# EAGLE design DIP-HDMI-v1.0 (EAGLE 7.6.0)

## Sheet 1 of 3
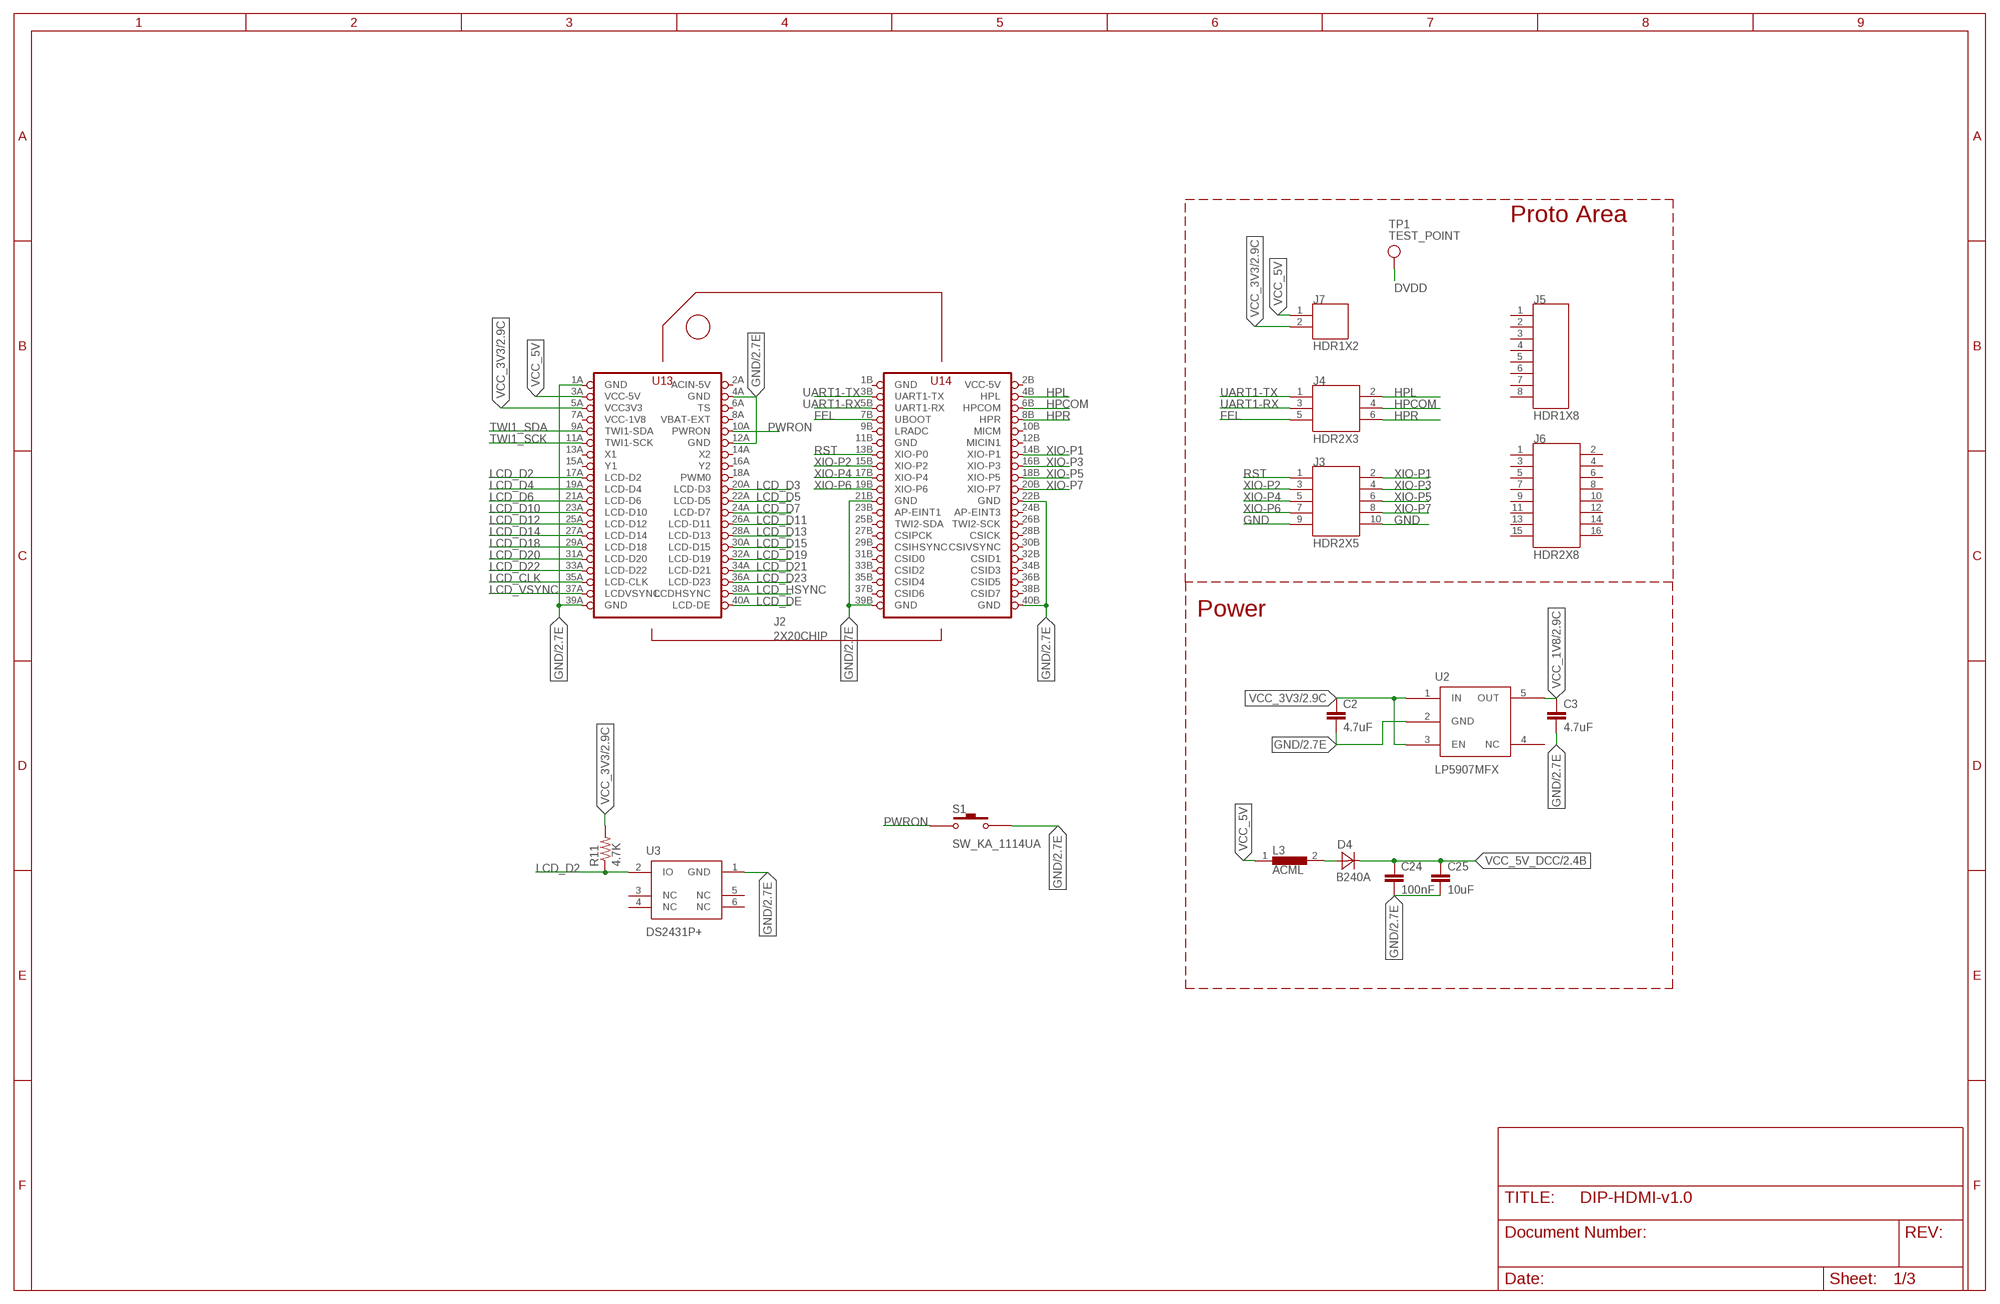
[diagram p0: schematic, sheet 1]

### Parts
C2  4.7uF  CAPACITOR  [1608_0603]
C3  4.7uF  CAPACITOR  [1608_0603]
C24  100nF  CAPACITOR  [1608_0603]
C25  10uF  CAPACITOR  [1608_0603]
D4  B240A  [SMA]
J2  2X20CHIP  [HDR2X2X20H]
J3  HDR2X5  [HDR2X5]
J4  HDR2X3  [HDR2X3]
J5  HDR1X8  [HDR1X8]
J6  HDR2X8  [HDR2X8]
J7  HDR1X2  [HDR1X2]
L3  ACML  [0603]
R11  4.7K  RESISTOR  [J1-0603]
S1  SW_KA_1114UA  [SW_KA_1114UA]
TP1  TEST_POINT  [TP-1MMX1MM]
U2  LP5907MFX  [SOT23-5]
U3  DS2431P+  [DS2431P+T&R]

### Nets
DVDD: TP1.0 ; also sheet 2
FEL: J2.7B(UBOOT) J4.5
GND: C2.2 C3.2 C24.2 C25.2 J2.1A(GND) J2.4A(GND) J2.12A(GND) J2.21B(GND) J2.22B(GND) J2.39A(GND) J2.39B(GND) J2.40B(GND) J3.9 J3.10 S1.3 S1.4 U2.2(GND) U3.1(GND) ; also sheet 2,3
HPCOM: J2.6B(HPCOM) J4.4
HPL: J2.4B(HPL) J4.2
HPR: J2.8B(HPR) J4.6
LCD_CLK: J2.35A(LCD-CLK) ; also sheet 2
LCD_D2: J2.17A(LCD-D2) R11.1 U3.2(IO)
LCD_D3: J2.20A(LCD-D3) ; also sheet 2
LCD_D4: J2.19A(LCD-D4) ; also sheet 2
LCD_D5: J2.22A(LCD-D5) ; also sheet 2
LCD_D6: J2.21A(LCD-D6) ; also sheet 2
LCD_D7: J2.24A(LCD-D7) ; also sheet 2
LCD_D10: J2.23A(LCD-D10) ; also sheet 2
LCD_D11: J2.26A(LCD-D11) ; also sheet 2
LCD_D12: J2.25A(LCD-D12) ; also sheet 2
LCD_D13: J2.28A(LCD-D13) ; also sheet 2
LCD_D14: J2.27A(LCD-D14) ; also sheet 2
LCD_D15: J2.30A(LCD-D15) ; also sheet 2
LCD_D18: J2.29A(LCD-D18) ; also sheet 2
LCD_D19: J2.32A(LCD-D19) ; also sheet 2
LCD_D20: J2.31A(LCD-D20) ; also sheet 2
LCD_D21: J2.34A(LCD-D21) ; also sheet 2
LCD_D22: J2.33A(LCD-D22) ; also sheet 2
LCD_D23: J2.36A(LCD-D23) ; also sheet 2
LCD_DE: J2.40A(LCD-DE) ; also sheet 2
LCD_HSYNC: J2.38A(LCDHSYNC) ; also sheet 2
LCD_VSYNC: J2.37A(LCDVSYNC) ; also sheet 2
N$7: D4.1(A) L3.2
PWRON: J2.10A(PWRON) S1.1 S1.2
RST: J2.13B(XIO-P0) J3.1 ; also sheet 2
TWI1_SCK: J2.11A(TWI1-SCK) ; also sheet 2,3
TWI1_SDA: J2.9A(TWI1-SDA) ; also sheet 2,3
UART1-RX: J2.5B(UART1-RX) J4.3
UART1-TX: J2.3B(UART1-TX) J4.1
VCC_1V8: C3.1 U2.5(OUT) ; also sheet 2
VCC_3V3: C2.1 J2.5A(VCC3V3) J7.2 R11.2 U2.1(IN) U2.3(EN) ; also sheet 2
VCC_5V: J2.3A(VCC-5V) J7.1 L3.1
VCC_5V_DCC: C24.1 C25.1 D4.2(C) ; also sheet 2,3
XIO-P1: J2.14B(XIO-P1) J3.2
XIO-P2: J2.15B(XIO-P2) J3.3
XIO-P3: J2.16B(XIO-P3) J3.4
XIO-P4: J2.17B(XIO-P4) J3.5
XIO-P5: J2.18B(XIO-P5) J3.6
XIO-P6: J2.19B(XIO-P6) J3.7
XIO-P7: J2.20B(XIO-P7) J3.8
Unconnected: J2.2A(ACIN-5V) J2.6A(TS) J2.8A(VBAT-EXT) J2.9B(LRADC) J2.10B(MICM) J2.12B(MICIN1) J2.13A(X1) J2.14A(X2) J2.15A(Y1) J2.16A(Y2) J2.18A(PWM0) J2.23B(AP-EINT1) J2.24B(AP-EINT3) J2.25B(TWI2-SDA) J2.26B(TWI2-SCK) J2.27B(CSIPCK) J2.28B(CSICK) J2.29B(CSIHSYNC) J2.30B(CSIVSYNC) J2.31B(CSID0) J2.32B(CSID1) J2.33B(CSID2) J2.34B(CSID3) J2.35B(CSID4) J2.36B(CSID5) J2.37B(CSID6) J2.38B(CSID7) J5.1 J5.2 J5.3 J5.4 J5.5 J5.6 J5.7 J5.8 J6.1 J6.2 J6.3 J6.4 J6.5 J6.6 J6.7 J6.8 J6.9 J6.10 J6.11 J6.12 J6.13 J6.14 J6.15 J6.16 U2.4(NC) U3.3(NC) U3.4(NC) U3.5(NC) U3.6(NC)

### Notes on the sheet
- Proto Area
- Power

## Sheet 2 of 3
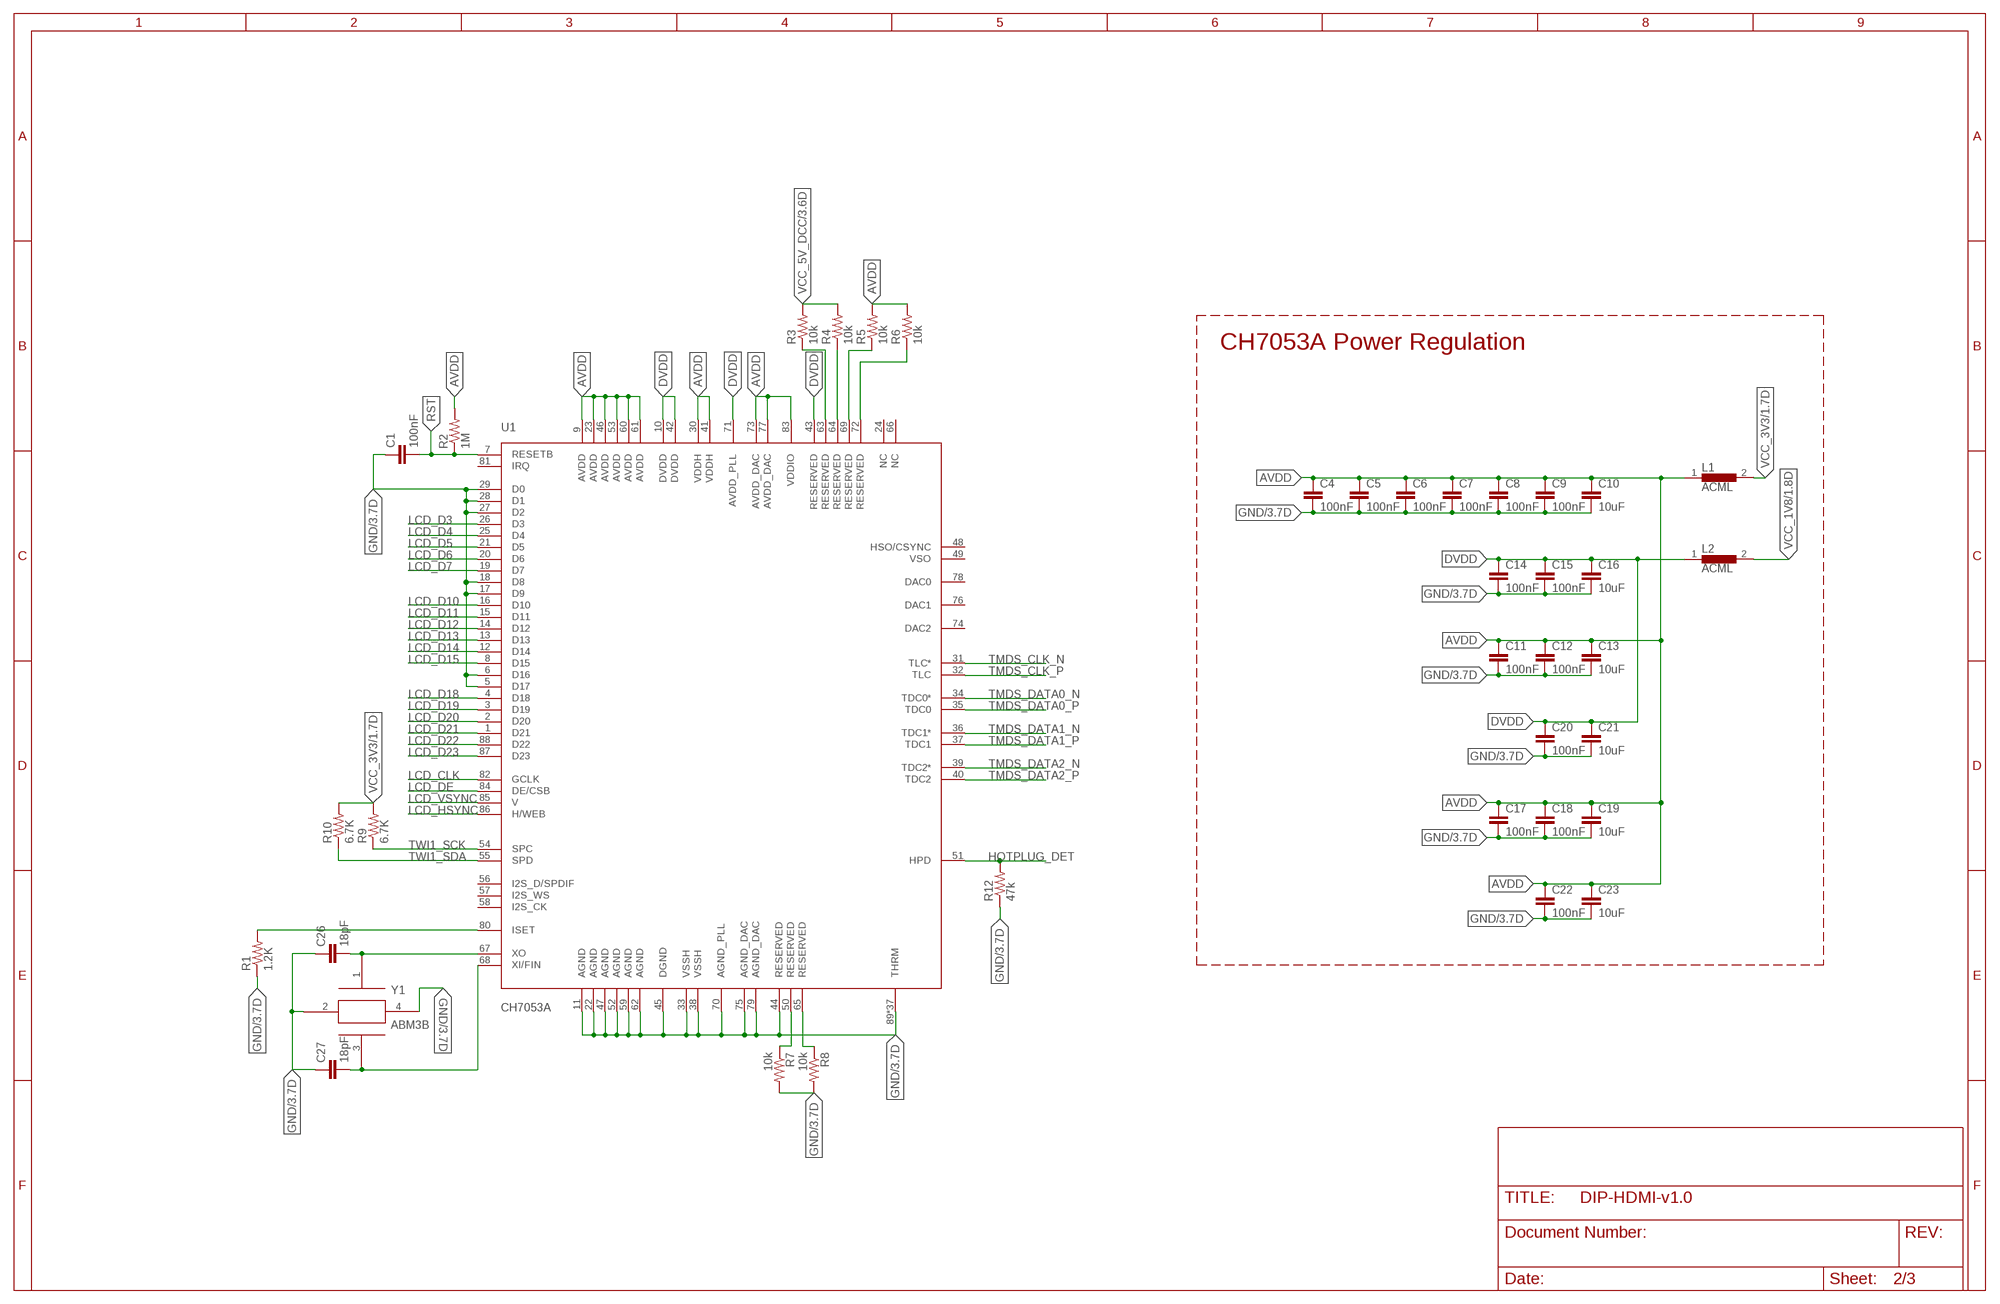
[diagram p1: schematic, sheet 2]

### Parts
C1  100nF  CAPACITOR  [1608_0603]
C4  100nF  CAPACITOR  [1608_0603]
C5  100nF  CAPACITOR  [1608_0603]
C6  100nF  CAPACITOR  [1608_0603]
C7  100nF  CAPACITOR  [1608_0603]
C8  100nF  CAPACITOR  [1608_0603]
C9  100nF  CAPACITOR  [1608_0603]
C10  10uF  CAPACITOR  [1608_0603]
C11  100nF  CAPACITOR  [1608_0603]
C12  100nF  CAPACITOR  [1608_0603]
C13  10uF  CAPACITOR  [1608_0603]
C14  100nF  CAPACITOR  [1608_0603]
C15  100nF  CAPACITOR  [1608_0603]
C16  10uF  CAPACITOR  [1608_0603]
C17  100nF  CAPACITOR  [1608_0603]
C18  100nF  CAPACITOR  [1608_0603]
C19  10uF  CAPACITOR  [1608_0603]
C20  100nF  CAPACITOR  [1608_0603]
C21  10uF  CAPACITOR  [1608_0603]
C22  100nF  CAPACITOR  [1608_0603]
C23  10uF  CAPACITOR  [1608_0603]
C26  18pF  CAPACITOR  [1608_0603]
C27  18pF  CAPACITOR  [1608_0603]
L1  ACML  [0603]
L2  ACML  [0603]
R1  1.2K  RESISTOR  [J1-0603]
R2  1M  RESISTOR  [J1-0603]
R3  10k  RESISTOR  [J1-0603]
R4  10k  RESISTOR  [J1-0603]
R5  10k  RESISTOR  [J1-0603]
R6  10k  RESISTOR  [J1-0603]
R7  10k  RESISTOR  [J1-0603]
R8  10k  RESISTOR  [J1-0603]
R9  6.7K  RESISTOR  [J1-0603]
R10  6.7K  RESISTOR  [J1-0603]
R12  47k  RESISTOR  [J1-0603]
U1  CH7053A  [QFN40P1000X1000X90_HS-89M]
Y1  ABM3B  [ABM3B]

### Nets
AVDD: C4.1 C5.1 C6.1 C7.1 C8.1 C9.1 C10.1 C11.1 C12.1 C13.1 C17.1 C18.1 C19.1 C22.1 C23.1 L1.1 R2.2 R5.2 R6.2 U1.9(AVDD) U1.23(AVDD) U1.30(VDDH) U1.41(VDDH) U1.46(AVDD) U1.53(AVDD) U1.60(AVDD) U1.61(AVDD) U1.73(AVDD_DAC) U1.77(AVDD_DAC) U1.83(VDDIO)
DVDD: C14.1 C15.1 C16.1 C20.1 C21.1 L2.1 U1.10(DVDD) U1.42(DVDD) U1.43(RESERVED) U1.71(AVDD_PLL) ; also sheet 1
GND: C1.1 C4.2 C5.2 C6.2 C7.2 C8.2 C9.2 C10.2 C11.2 C12.2 C13.2 C14.2 C15.2 C16.2 C17.2 C18.2 C19.2 C20.2 C21.2 C22.2 C23.2 C26.1 C27.1 R1.1 R7.2 R8.2 R12.1 U1.5(D17) U1.6(D16) U1.11(AGND) U1.17(D9) U1.18(D8) U1.22(AGND) U1.27(D2) U1.28(D1) U1.29(D0) U1.33(VSSH) U1.38(VSSH) U1.44(RESERVED) U1.45(DGND) U1.47(AGND) U1.52(AGND) U1.59(AGND) U1.62(AGND) U1.70(AGND_PLL) U1.75(AGND_DAC) U1.79(AGND_DAC) U1.89(THRM) U1.P$1(THRM) U1.P$2(THRM) U1.P$3(THRM) U1.P$4(THRM) U1.P$5(THRM) U1.P$6(THRM) U1.P$7(THRM) U1.P$8(THRM) U1.P$9(THRM) U1.P$10(THRM) U1.P$11(THRM) U1.P$12(THRM) U1.P$13(THRM) U1.P$14(THRM) U1.P$15(THRM) U1.P$16(THRM) U1.P$17(THRM) U1.P$18(THRM) U1.P$19(THRM) U1.P$20(THRM) U1.P$21(THRM) U1.P$22(THRM) U1.P$23(THRM) U1.P$24(THRM) U1.P$25(THRM) U1.P$26(THRM) U1.P$27(THRM) U1.P$28(THRM) U1.P$29(THRM) U1.P$30(THRM) U1.P$31(THRM) U1.P$32(THRM) U1.P$33(THRM) U1.P$34(THRM) U1.P$35(THRM) U1.P$36(THRM) Y1.2 Y1.4 ; also sheet 1,3
HOTPLUG_DET: R12.2 U1.51(HPD) ; also sheet 3
LCD_CLK: U1.82(GCLK) ; also sheet 1
LCD_D3: U1.26(D3) ; also sheet 1
LCD_D4: U1.25(D4) ; also sheet 1
LCD_D5: U1.21(D5) ; also sheet 1
LCD_D6: U1.20(D6) ; also sheet 1
LCD_D7: U1.19(D7) ; also sheet 1
LCD_D10: U1.16(D10) ; also sheet 1
LCD_D11: U1.15(D11) ; also sheet 1
LCD_D12: U1.14(D12) ; also sheet 1
LCD_D13: U1.13(D13) ; also sheet 1
LCD_D14: U1.12(D14) ; also sheet 1
LCD_D15: U1.8(D15) ; also sheet 1
LCD_D18: U1.4(D18) ; also sheet 1
LCD_D19: U1.3(D19) ; also sheet 1
LCD_D20: U1.2(D20) ; also sheet 1
LCD_D21: U1.1(D21) ; also sheet 1
LCD_D22: U1.88(D22) ; also sheet 1
LCD_D23: U1.87(D23) ; also sheet 1
LCD_DE: U1.84(DE/CSB) ; also sheet 1
LCD_HSYNC: U1.86(H/WEB) ; also sheet 1
LCD_VSYNC: U1.85(V) ; also sheet 1
N$1: C26.2 U1.67(XO) Y1.1
N$2: C27.2 U1.68(XI/FIN) Y1.3
N$3: R1.2 U1.80(ISET)
N$4: R7.1 U1.50(RESERVED)
N$5: R8.1 U1.65(RESERVED)
N$6: R5.1 U1.69(RESERVED)
N$17: R3.1 U1.63(RESERVED)
N$18: R4.1 U1.64(RESERVED)
N$20: R6.1 U1.72(RESERVED)
RST: C1.2 R2.1 U1.7(RESETB) ; also sheet 1
TMDS_CLK_N: U1.31(TLC*) ; also sheet 3
TMDS_CLK_P: U1.32(TLC) ; also sheet 3
TMDS_DATA0_N: U1.34(TDC0*) ; also sheet 3
TMDS_DATA0_P: U1.35(TDC0) ; also sheet 3
TMDS_DATA1_N: U1.36(TDC1*) ; also sheet 3
TMDS_DATA1_P: U1.37(TDC1) ; also sheet 3
TMDS_DATA2_N: U1.39(TDC2*) ; also sheet 3
TMDS_DATA2_P: U1.40(TDC2) ; also sheet 3
TWI1_SCK: R9.1 U1.54(SPC) ; also sheet 1,3
TWI1_SDA: R10.1 U1.55(SPD) ; also sheet 1,3
VCC_1V8: L2.2 ; also sheet 1
VCC_3V3: L1.2 R9.2 R10.2 ; also sheet 1
VCC_5V_DCC: R3.2 R4.2 ; also sheet 1,3
Unconnected: U1.24(NC) U1.48(HSO/CSYNC) U1.49(VSO) U1.56(I2S_D/SPDIF) U1.57(I2S_WS) U1.58(I2S_CK) U1.66(NC) U1.74(DAC2) U1.76(DAC1) U1.78(DAC0) U1.81(IRQ)

### Notes on the sheet
- CH7053A Power Regulation

## Sheet 3 of 3
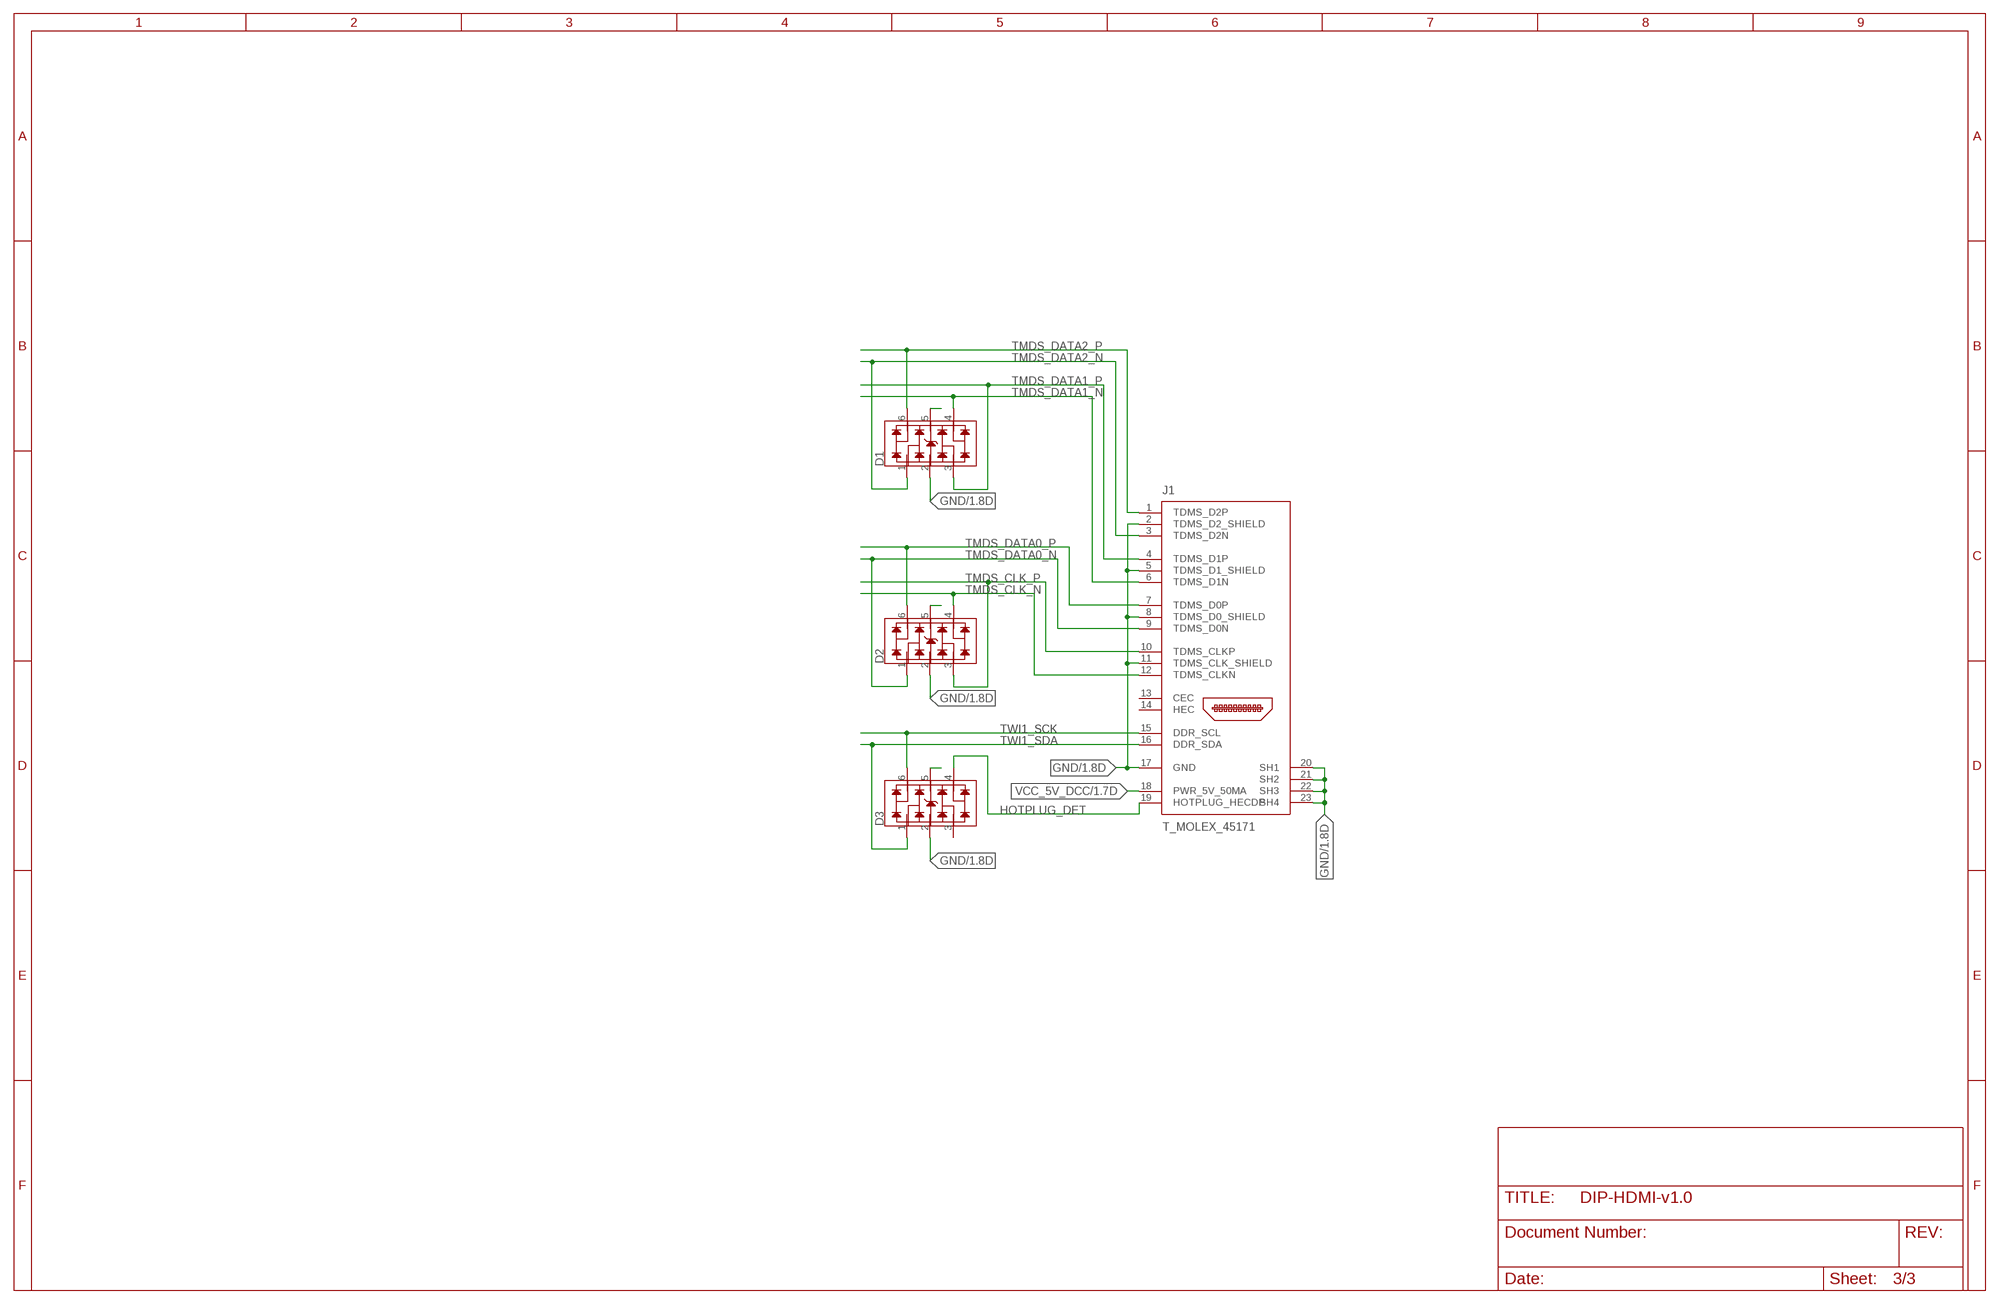
[diagram p2: schematic, sheet 3]

### Parts
D1  D-SEMTECH-RCLAMP0504S  [T_SOT95P285X90-6N]
D2  D-SEMTECH-RCLAMP0504S  [T_SOT95P285X90-6N]
D3  D-SEMTECH-RCLAMP0504S  [T_SOT95P285X90-6N]
J1  T_MOLEX_45171  [T_MOLEX_45171]

### Nets
GND: D1.2 D2.2 D3.2 J1.2(TDMS_D2_SHIELD) J1.5(TDMS_D1_SHIELD) J1.8(TDMS_D0_SHIELD) J1.11(TDMS_CLK_SHIELD) J1.17(GND) J1.20(SH1) J1.21(SH2) J1.22(SH3) J1.23(SH4) ; also sheet 1,2
HOTPLUG_DET: D3.4 J1.19(HOTPLUG_HECDP) ; also sheet 2
N$8: D1.5
N$9: D2.5
N$10: D3.5
TMDS_CLK_N: D2.4 J1.12(TDMS_CLKN) ; also sheet 2
TMDS_CLK_P: D2.3 J1.10(TDMS_CLKP) ; also sheet 2
TMDS_DATA0_N: D2.1 J1.9(TDMS_D0N) ; also sheet 2
TMDS_DATA0_P: D2.6 J1.7(TDMS_D0P) ; also sheet 2
TMDS_DATA1_N: D1.4 J1.6(TDMS_D1N) ; also sheet 2
TMDS_DATA1_P: D1.3 J1.4(TDMS_D1P) ; also sheet 2
TMDS_DATA2_N: D1.1 J1.3(TDMS_D2N) ; also sheet 2
TMDS_DATA2_P: D1.6 J1.1(TDMS_D2P) ; also sheet 2
TWI1_SCK: D3.6 J1.15(DDR_SCL) ; also sheet 1,2
TWI1_SDA: D3.1 J1.16(DDR_SDA) ; also sheet 1,2
VCC_5V_DCC: J1.18(PWR_5V_50MA) ; also sheet 1,2
Unconnected: D3.3 J1.13(CEC) J1.14(HEC)

## Power pins joined to a net without a drawn wire
GND: J2.1B(GND) J2.11B(GND)
VCC-1V8: J2.7A(VCC-1V8)
VCC-5V: J2.2B(VCC-5V)

## Library data of the parts
C1-C27 = CHIP_HDMI:CAPACITOR
D1-D3 = CHIP_HDMI:D-SEMTECH-RCLAMP0504S
D4 = CHIP_HDMI:B240A
J1 = CHIP_HDMI:T_MOLEX_45171
J2 = CHIP_HDMI:2X20CHIP
J3 = CHIP_HDMI:HDR2X5
J4 = CHIP_HDMI:HDR2X3
J5 = CHIP_HDMI:HDR1X8
J6 = CHIP_HDMI:HDR2X8
J7 = CHIP_HDMI:HDR1X2
L1-L3 = CHIP_HDMI:ACML
R1-R12 = CHIP_HDMI:RESISTOR
S1 = CHIP_HDMI:SW_KA_1114UA
TP1 = CHIP_HDMI:TEST_POINT
U1 = CHIP_HDMI:CH7053A
U2 = CHIP_HDMI:LP5907MFX
U3 = CHIP_HDMI:DS2431P+
Y1 = CHIP_HDMI:ABM3B

## Board
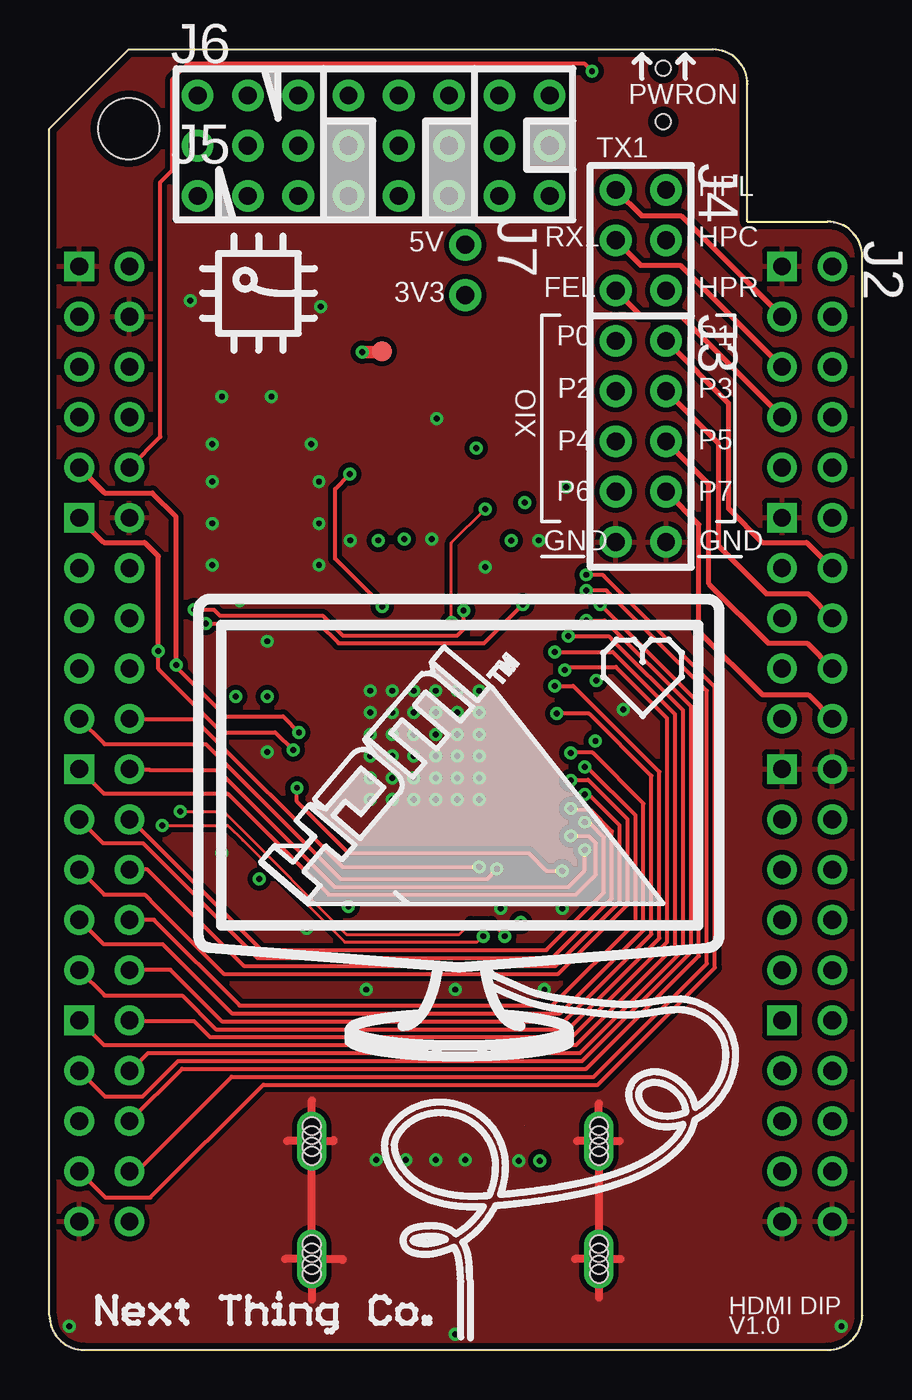
[diagram p3: board, top side]
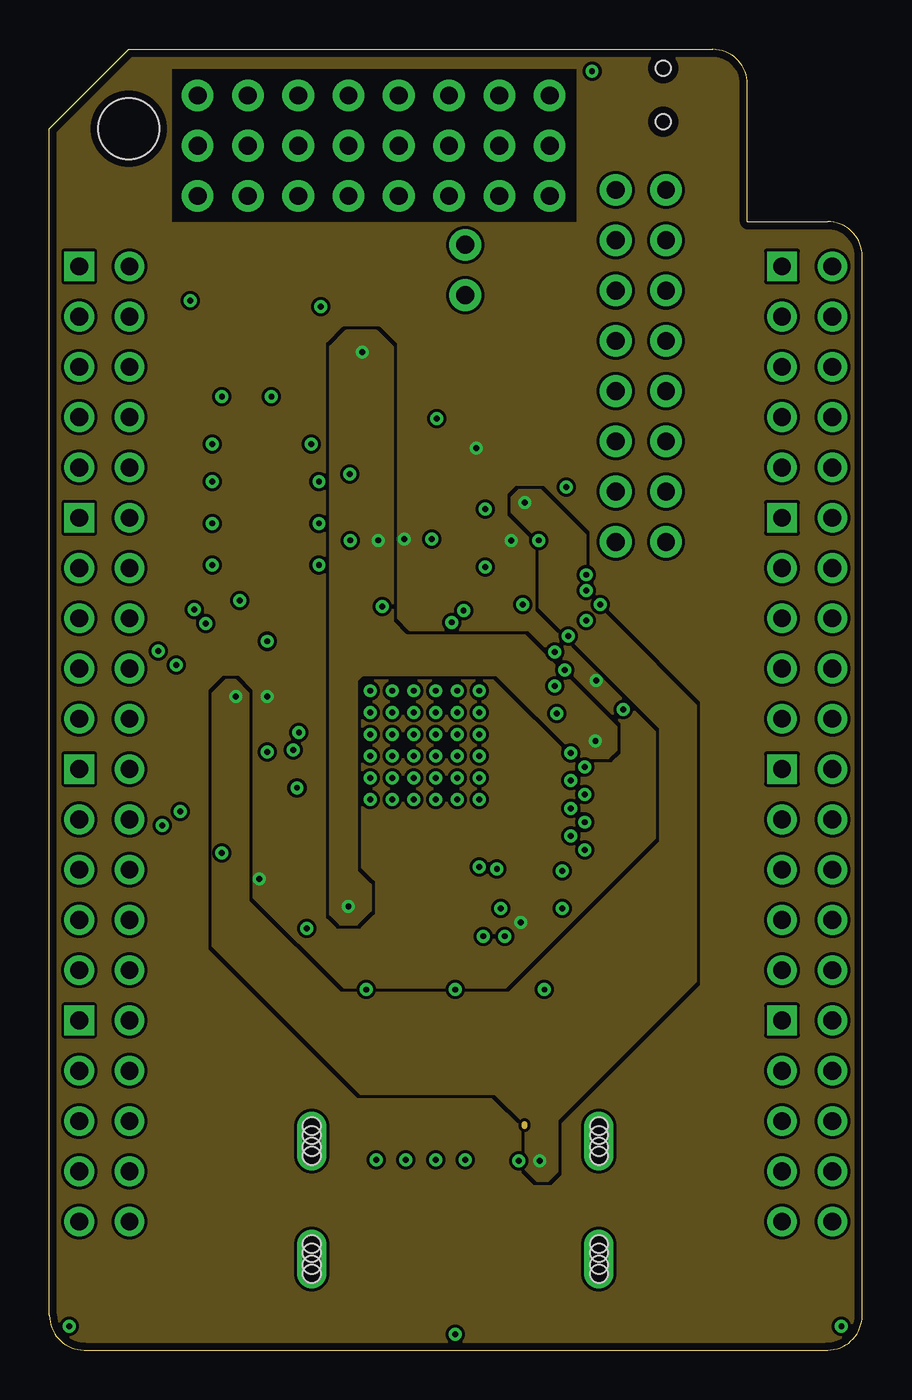
[diagram p4: board, inner layer PWR]
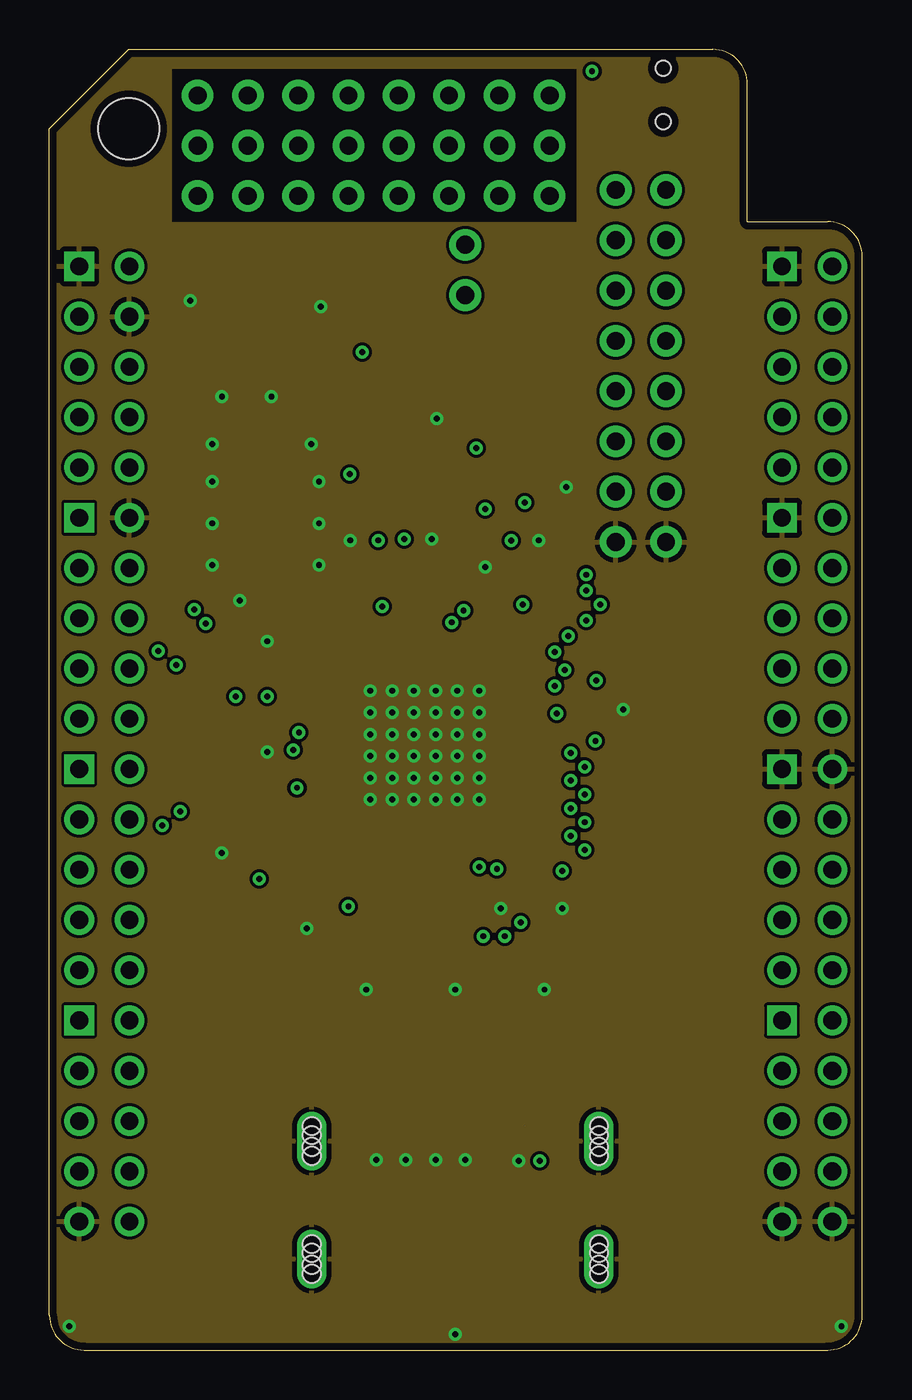
[diagram p5: board, inner layer GND]
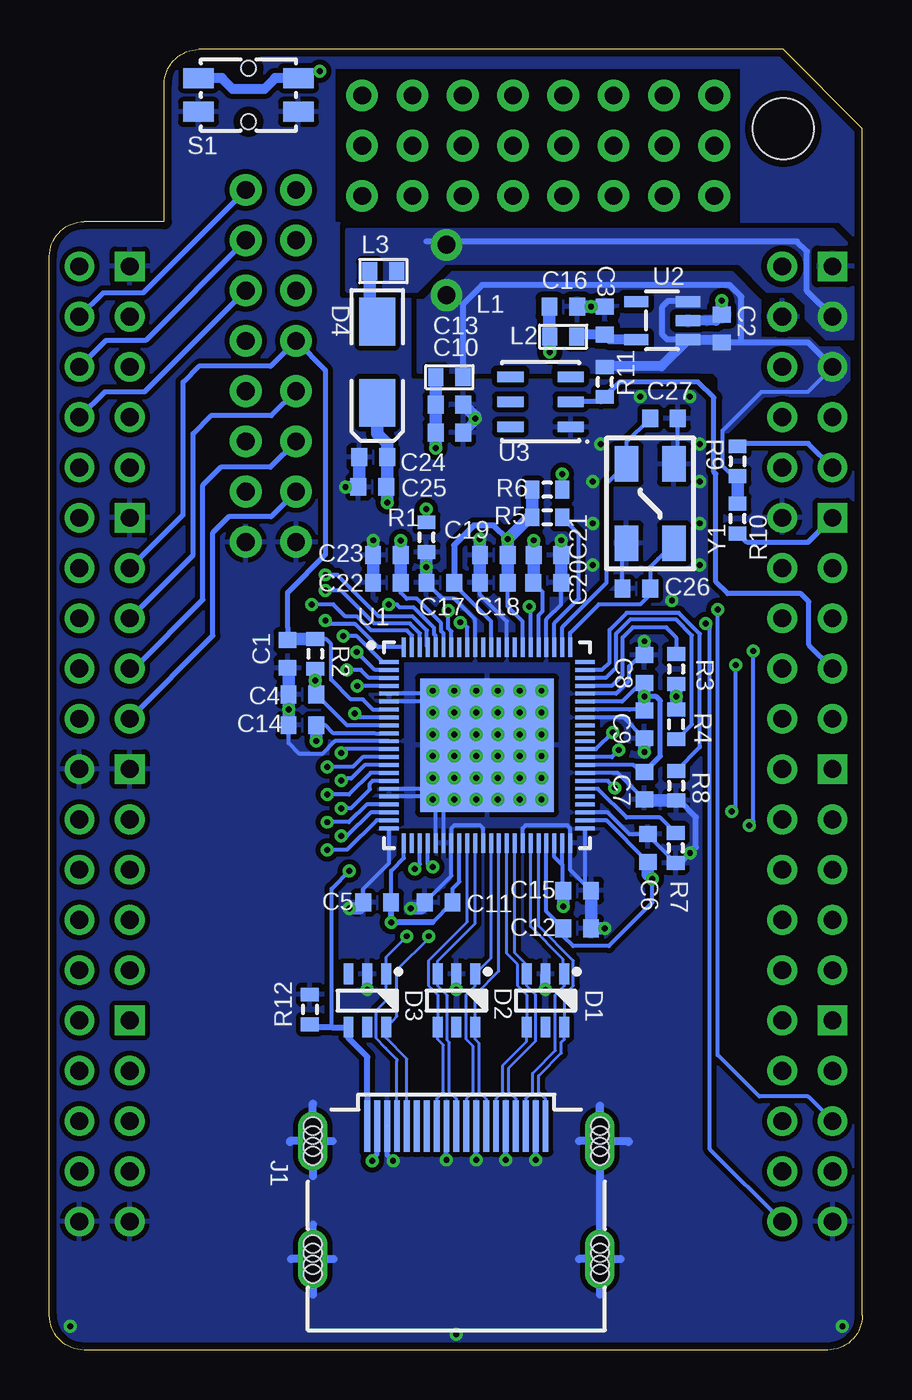
[diagram p6: board, bottom side, seen from below]

Size 41.05 x 65.71 mm. Coordinates in mm from the lower left corner, seen from the top.
Outline: 0,1.75 arc90 1.75,0 39.3,0 arc90 41.05,1.75 41.05,55.26 arc90 39.3,57.01 35.25,57.01 35.25,63.96 arc90 33.5,65.71 4,65.71 0,61.71 0,1.75
Copper layers (1*2*15*16): Top 0.0356mm / dielectric 1.5011mm / PWR 0.0356mm / dielectric 0.1499mm / GND 0.0356mm / dielectric 0.2007mm / Bottom 0.0356mm
Design rules "CHIP_HDMI *": minimum track width 6mil, minimum drill 0.3mm, track to track 5mil, track to pad 5mil, pad to pad 5mil, via to via 5mil, smd to smd 0mil, copper to edge 15mil, drill to drill 10mil, minimum pad ring 7mil, minimum via ring 7mil, stop-mask expansion 0mil, vias tented up to drill 0.6mm, thermal gap 10mil

### Footprints (pad centres in the part's own frame; a part is rotated, then mirrored left to right if it is on the bottom)
1608_0603 = smd 0.8 x 0.9: 1 -0.7,0; 2 0.7,0
T_SOT95P285X90-6N = smd 1.05 x 0.5: 1 0,0; 2 0,-0.95; 3 0,-1.9; 4 2.7,-1.9; 5 2.7,-0.95; 6 2.7,0
SMA = smd 2.4 x 1.8: 1 -2.05,0; 2 2.05,0
T_MOLEX_45171 = smd 0.3 x 2.6: 1 4.5,10.31; 2 4,10.31; 3 3.5,10.31; 4 3,10.31; 5 2.5,10.31; 6 2,10.31; 7 1.5,10.31; 8 1,10.31; 9 0.5,10.31; 10 0,10.31; 11 -0.5,10.31; 12 -1,10.31; 13 -1.5,10.31; 14 -2,10.31; 15 -2.5,10.31; 16 -3,10.31; 17 -3.5,10.31; 18 -4,10.31; 19 -4.5,10.31 | drill 0.9 pad 1.499 long: 20 -7.25,3.59; 21 7.25,3.59; 22 7.25,9.55; 23 -7.25,9.55 | hole 0.9: -7.25,10.3; -7.25,8.8; -7.25,9.85; -7.25,9.25; -7.25,4.35; -7.25,2.85; -7.25,3.9; -7.25,3.3; 7.25,10.3; 7.25,8.8; 7.25,9.85; 7.25,9.25; 7.25,4.35; 7.25,3.9; 7.25,2.85; 7.25,3.3
HDR2X2X20H = drill 0.9 pad 1.5 square: 1A 0,0; 1B 0,35.5; 11A 12.7,0; 11B 12.7,35.5; 21A 25.4,0; 21B 25.4,35.5; 31A 38.1,0; 31B 38.1,35.5 | drill 0.9 pad 1.5: 2A 0,2.54; 2B 0,38.04; 3A 2.54,0; 3B 2.54,35.5; 4A 2.54,2.54; 4B 2.54,38.04; 5A 5.08,0; 5B 5.08,35.5; 6A 5.08,2.54; 6B 5.08,38.04; 7A 7.62,0; 7B 7.62,35.5; 8A 7.62,2.54; 8B 7.62,38.04; 9A 10.16,0; 9B 10.16,35.5; 10A 10.16,2.54; 10B 10.16,38.04; 12A 12.7,2.54; 12B 12.7,38.04; 13A 15.24,0; 13B 15.24,35.5; 14A 15.24,2.54; 14B 15.24,38.04; 15A 17.78,0; 15B 17.78,35.5; 16A 17.78,2.54; 16B 17.78,38.04; 17A 20.32,0; 17B 20.32,35.5; 18A 20.32,2.54; 18B 20.32,38.04; 19A 22.86,0; 19B 22.86,35.5; 20A 22.86,2.54; 20B 22.86,38.04; 22A 25.4,2.54; 22B 25.4,38.04; 23A 27.94,0; 23B 27.94,35.5; 24A 27.94,2.54; 24B 27.94,38.04; 25A 30.48,0; 25B 30.48,35.5; 26A 30.48,2.54; 26B 30.48,38.04; 27A 33.02,0; 27B 33.02,35.5; 28A 33.02,2.54; 28B 33.02,38.04; 29A 35.56,0; 29B 35.56,35.5; 30A 35.56,2.54; 30B 35.56,38.04; 32A 38.1,2.54; 32B 38.1,38.04; 33A 40.64,0; 33B 40.64,35.5; 34A 40.64,2.54; 34B 40.64,38.04; 35A 43.18,0; 35B 43.18,35.5; 36A 43.18,2.54; 36B 43.18,38.04; 37A 45.72,0; 37B 45.72,35.5; 38A 45.72,2.54; 38B 45.72,38.04; 39A 48.26,0; 39B 48.26,35.5; 40A 48.26,2.54; 40B 48.26,38.04
HDR2X5 = drill 0.9 pad 1.6: 1 0,0; 2 0,2.54; 3 2.54,0; 4 2.54,2.54; 5 5.08,0; 6 5.08,2.54; 7 7.62,0; 8 7.62,2.54; 9 10.16,0; 10 10.16,2.54
HDR2X3 = drill 0.9 pad 1.6: 1 0,0; 2 0,2.54; 3 2.54,0; 4 2.54,2.54; 5 5.08,0; 6 5.08,2.54
HDR1X8 = drill 0.9 pad 1.6: 1 0,0; 2 2.54,0; 3 5.08,0; 4 7.62,0; 5 10.16,0; 6 12.7,0; 7 15.24,0; 8 17.78,0
HDR2X8 = drill 0.9 pad 1.6: 1 0,0; 2 0,2.54; 3 2.54,0; 4 2.54,2.54; 5 5.08,0; 6 5.08,2.54; 7 7.62,0; 8 7.62,2.54; 9 10.16,0; 10 10.16,2.54; 11 12.7,0; 12 12.7,2.54; 13 15.24,0; 14 15.24,2.54; 15 17.78,0; 16 17.78,2.54
HDR1X2 = drill 0.9 pad 1.6: 1 0,0; 2 2.54,0
0603 = smd 0.762 x 0.914: 1 -0.686,0; 2 0.686,0
J1-0603 = smd 0.7 x 0.9: 1 -0.75,0; 2 0.75,0
SW_KA_1114UA = smd 1.55 x 1: 1 2.525,0.85; 2 -2.525,0.85; 3 -2.525,-0.85; 4 2.525,-0.85 | hole 0.75: 0,1.35; 0,-1.35
TP-1MMX1MM = smd 1 x 1: 0 0,0
QFN40P1000X1000X90_HS-89M = smd 1 x 0.2: 1 -4.95,4.2; 2 -4.95,3.8; 3 -4.95,3.4; 4 -4.95,3; 5 -4.95,2.6; 6 -4.95,2.2; 7 -4.95,1.8; 8 -4.95,1.4; 9 -4.95,1; 10 -4.95,0.6; 11 -4.95,0.2; 12 -4.95,-0.2; 13 -4.95,-0.6; 14 -4.95,-1; 15 -4.95,-1.4; 16 -4.95,-1.8; 17 -4.95,-2.2; 18 -4.95,-2.6; 19 -4.95,-3; 20 -4.95,-3.4; 21 -4.95,-3.8; 22 -4.95,-4.2; 45 4.95,-4.2; 46 4.95,-3.8; 47 4.95,-3.4; 48 4.95,-3; 49 4.95,-2.6; 50 4.95,-2.2; 51 4.95,-1.8; 52 4.95,-1.4; 53 4.95,-1; 54 4.95,-0.6; 55 4.95,-0.2; 56 4.95,0.2; 57 4.95,0.6; 58 4.95,1; 59 4.95,1.4; 60 4.95,1.8; 61 4.95,2.2; 62 4.95,2.6; 63 4.95,3; 64 4.95,3.4; 65 4.95,3.8; 66 4.95,4.2 | smd 0.2 x 1: 23 -4.2,-4.95; 24 -3.8,-4.95; 25 -3.4,-4.95; 26 -3,-4.95; 27 -2.6,-4.95; 28 -2.2,-4.95; 29 -1.8,-4.95; 30 -1.4,-4.95; 31 -1,-4.95; 32 -0.6,-4.95; 33 -0.2,-4.95; 34 0.2,-4.95; 35 0.6,-4.95; 36 1,-4.95; 37 1.4,-4.95; 38 1.8,-4.95; 39 2.2,-4.95; 40 2.6,-4.95; 41 3,-4.95; 42 3.4,-4.95; 43 3.8,-4.95; 44 4.2,-4.95; 67 4.2,4.95; 68 3.8,4.95; 69 3.4,4.95; 70 3,4.95; 71 2.6,4.95; 72 2.2,4.95; 73 1.8,4.95; 74 1.4,4.95; 75 1,4.95; 76 0.6,4.95; 77 0.2,4.95; 78 -0.2,4.95; 79 -0.6,4.95; 80 -1,4.95; 81 -1.4,4.95; 82 -1.8,4.95; 83 -2.2,4.95; 84 -2.6,4.95; 85 -3,4.95; 86 -3.4,4.95; 87 -3.8,4.95; 88 -4.2,4.95 | smd 6.75 x 6.75: 89 0,0 | drill 0.3 pad 0.61: P$1 -2.75,2.75; P$2 2.75,2.75; P$3 -2.75,-2.75; P$4 2.75,-2.75; P$5 -1.65,2.75; P$6 -0.55,2.75; P$7 1.65,2.75; P$8 0.55,2.75; P$9 -1.65,-2.75; P$10 -0.55,-2.75; P$11 1.65,-2.75; P$12 0.55,-2.75; P$13 -2.75,1.65; P$14 -2.75,0.55; P$15 -2.75,-0.55; P$16 -2.75,-1.65; P$17 2.75,1.65; P$18 2.75,0.55; P$19 2.75,-0.55; P$20 2.75,-1.65; P$21 -1.65,1.65; P$22 -0.55,1.65; P$23 0.55,1.65; P$24 1.65,1.65; P$25 -1.65,0.55; P$26 -0.55,0.55; P$27 0.55,0.55; P$28 1.65,0.55; P$29 -1.65,-0.55; P$30 -0.55,-0.55; P$31 0.55,-0.55; P$32 1.65,-0.55; P$33 1.65,-1.65; P$34 0.55,-1.65; P$35 -0.55,-1.65; P$36 -1.65,-1.65
SOT23-5 = smd 0.559 x 1.219: 1 -0.95,-1.3; 2 0,-1.3; 3 0.965,-1.3; 4 0.965,1.321; 5 -0.95,1.321
DS2431P+T&R = smd 1.33 x 0.53: 1 -1.525,1.27; 2 -1.525,0; 3 -1.525,-1.27; 4 1.525,-1.27; 5 1.525,0; 6 1.525,1.27
MOUNTINGHOLE = hole 3.08: 0,0
ABM3B = smd 1.8 x 1.2: 1 -2,-1.2; 2 2,-1.2; 3 2,1.2; 4 -2,1.2

### Placement (x,y rotation side)
C1  29.03,35.17 90 bottom
C2  7.1,51.61 90 bottom
C3  13,52.01 90 bottom
C4  28.28,33.12 180 bottom
C5  24.5,22.61 180 bottom
C6  10.83,25.37 90 bottom
C7  11,28.51 270 bottom
C8  11,34.41 90 bottom
C9  11,31.61 270 bottom
C10  20.85,46.36 0 bottom
C11  21.4,22.61 180 bottom
C12  14.4,21.31 0 bottom
C13  20.85,47.76 0 bottom
C14  28.28,31.57 180 bottom
C15  14.4,23.21 0 bottom
C16  15.1,52.71 0 bottom
C17  21.31,38.77 180 bottom
C18  18.61,38.77 180 bottom
C19  18.61,40.17 180 bottom
C20  15.91,38.77 0 bottom
C21  15.9,40.17 0 bottom
C22  24.01,38.77 180 bottom
C23  24.01,40.17 180 bottom
C24  24.7,45.11 180 bottom
C25  24.75,43.61 180 bottom
C26  11.41,38.47 0 bottom
C27  10.01,47.07 180 bottom
D1  15.05,19.01 270 bottom
D2  19.55,19.01 270 bottom
D3  24.05,19.01 270 bottom
D4  24.5,49.91 270 bottom
J1  20.5,1.01 0 bottom
J2  1.5,54.75 270 top
J3  28.6,50.99 270 top
J4  28.6,58.61 270 top
J5  7.48,58.31 0 top
J6  7.48,60.85 0 top
J7  21,55.84 270 top
L1  20.85,49.16 0 bottom
L2  15.1,51.21 0 bottom
L3  24.2,54.51 180 bottom
R1  22.01,41.07 90 bottom
R2  27.63,35.17 270 bottom
R3  9.4,34.41 270 bottom
R4  9.4,31.61 90 bottom
R5  15.91,42.07 180 bottom
R6  15.91,43.47 180 bottom
R7  9.43,25.37 270 bottom
R8  9.4,28.51 270 bottom
R9  6.3,42.01 90 bottom
R10  6.3,44.91 270 bottom
R11  13,48.91 90 bottom
R12  27.9,17.21 270 bottom
S1  31,63.41 0 bottom
TP1  16.8,50.45 0 top
U1  18.95,30.56 0 bottom
U2  10.1,52.01 90 bottom
U3  16.25,47.91 180 bottom
U$2  [MOUNTINGHOLE]  4,61.71 0 top
Y1  10.71,42.77 90 bottom

### Tracks (layer width: path | path; a pad name or v marks a point on that pad's centre or on a via)
AVDD  (via drill 0.3 pad 0.61)
  Bottom 0.152: v11,33.01 | v10.6,23.81
  Bottom 0.203: v10.6,23.81 10.6,22.61 12.8,20.41 14.6,20.41 15.1,20.91 C12.1 | C5.1 23.8,24.21 23.15,24.86 U1.23 | U1.53 11.55,29.56 11.2,29.21 C7.1 | C8.1 11.18,33.71 12.13,32.76 U1.61 | 15.95,22.16 U1.41 | U1.30 20.35,23.66 20.7,23.31 C11.1 21.7,21.61 | U1.9 26.02,31.56 C4.1 | U1.46 12.92,26.76 C6.1 | U1.73 17.15,36.81 17.91,37.57 C18.1 | U1.77 18.75,36.81 20.61,38.67 C17.1 | U1.83 21.15,36.2 21.27,36.32 21.27,36.72 22.51,37.97 23.01,37.97 23.31,38.27 | 15.95,22.16 | 15.95,22.16 C12.1 | C12.1 | C9.1 11.05,32.36 11.75,32.36 13.35,32.36 U1.60 | U1.23 | 23.31,38.27 | 23.31,38.27 C22.1 | C18.1 | C6.1 | C6.1 | U1.60
  Bottom 0.254: C7.1 10.2,30.01 10.2,32.81 10.4,33.01 v11,33.01 | v11,33.01
  Bottom 0.305: C5.1 v23.8,21.61 21.7,21.61 | v17.91,40.97 18.61,41.67 19.61,41.67 20.61,40.67 C17.1 | C17.1
  Bottom 0.635: v10.6,23.81 10.83,24.03 C6.1 | C8.1 v11,33.01 C9.1 | 27.63,33.17 v27.63,33.82 | C4.1 27.63,33.17 | 27.63,33.17 | 27.65,34.4 27.64,34.4 R2.2 v27.63,33.82 | v27.63,33.82 | v23.31,40.9 | v23.31,40.9 C23.1 C22.1 | v17.91,40.97 C19.1 | C19.1 | v17.91,40.97 C18.1 | C18.1 | v17.91,40.97 16.83,42.05 16.68,42.05 R5.2 R6.2 | L1.1 21.55,49.14 C13.1 C10.1 | C10.1 | C10.1 v21.55,45.56
  pour PWR (isolate 0.152, rank 2, no thermals): 0,1.75 0,61.71 4,65.71 33.5,65.71 33.8,65.68 34.1,65.6 34.38,65.47 34.62,65.3 34.84,65.08 35.02,64.83 35.14,64.56 35.22,64.26 35.25,63.96 35.25,57.01 39.3,57.01 arc-90 41.05,55.26 41.05,1.75 arc-90 39.3,0 1.75,0 arc-90
DVDD  (via drill 0.3 pad 0.61)
  Top 0.203: TP1.0 16.77,50.45 16.77,50.42
  Top 0.635: v15.79,50.42 16.77,50.42
  Bottom 0.203: 15.15,24.51 U1.43 | 15.15,24.51 15.55,24.91 U1.42 | 27.13,31.57 26.72,31.16 24.6,31.16 U1.10 | U1.71 16.35,37.13 16.15,37.33 16.15,38.31 | 15.15,24.51 15.15,23.26 C15.1 | 27.13,31.57 | 27.13,31.57 C14.1 | 16.15,38.31 | 16.15,38.31 C20.1 | U1.42 | U1.10
  Bottom 0.635: v15.79,50.42 L2.1 15.8,51.22 C16.1 | C15.1 v15.1,22.41 | v15.1,22.41 | v27.58,30.77 | v27.58,30.77 C14.1 | 16.61,40.16 C21.1 | v16.6,40.91 C21.1 | C21.1 C20.1
  pour PWR (isolate 0.152): 14.2,50.7 15,51.5 16.5,51.5 17.3,50.7 17.3,36.8 18,36.1 24,36.1 28.6,31.5 28.6,30.3 28.2,29.9 26.8,29.9 22.6,34.1 15.8,34.1 15.5,33.8 15.5,24.2 16.2,23.5 16.2,22.2 15.5,21.5 14.7,21.5 14.2,22
FEL
  Top 0.203: J2.7B | J2.7B
  Top 0.254: J4.5 29.82,52.31 31.82,52.31 J2.7B
GND  (via drill 0.3 pad 0.61)  (1 unrouted)
  Top 0.406: J1.21 J1.22 | J1.22 13.25,12.6 | J1.22 12,10.56 | J1.22 14.35,10.56 14.35,10.6 | J1.21 13.25,2.55 | J1.21 11.9,4.6 | J1.21 14.8,4.6 14.8,4.55 | J1.23 28.8,10.56 28.8,10.55 | J1.23 27.75,12.45 | J1.23 26.65,10.56 26.65,10.55 | J1.23 J1.20 | J1.20 28.85,4.6 | J1.20 26.55,4.6 | J1.20 27.75,2.65
  PWR 0.305: J1.17 24,11.41
  Bottom 0.152: U1.P$1 21.65,33.31 21.65,33.16 | J1.17 arc3 24,11.3
  Bottom 0.203: 14.4,23.91 14.75,24.26 U1.44 14.75,26.36 14.9,26.51 17,26.51 17.15,26.36 U1.38 | C5.2 25.2,23.31 23.9,24.61 U1.22 | U1.47 12.85,27.16 11.76,26.07 C6.2 10.83,26.02 R7.2 | C7.2 12.35,29.16 U1.52 | C9.2 12.05,31.96 U1.59 | U1.62 12.43,33.16 11.77,33.82 11.77,34.54 11.2,35.11 C8.2 | U1.45 14,23.51 C15.2 14.4,23.91 | U1.33 19.15,26.36 19.3,26.51 20.6,26.51 20.75,26.36 U1.29 20.75,23.96 C11.2 | U1.28 21.15,28.36 U1.17 | 21.15,32.76 U1.6 | U1.11 26.63,30.76 27.28,30.12 28.43,30.12 28.98,30.67 C14.2 | U1.70 15.95,36.93 15.21,37.67 C20.2 | 17.95,35.6 U1.75 17.95,35.6 | 17.95,35.6 17.95,36.81 19.31,38.17 C18.2 | U1.79 19.55,36.91 20.61,37.97 21.21,37.97 C17.2 | U1.27 21.55,27.96 U1.18 | 21.55,33.16 21.65,33.16 U1.5 | 14.4,23.91 | R7.2 9.43,24.67 R7.2 | C17.2 | C18.2 | C20.2 | C26.1 | 9.31,44.97 | 9.31,44.97 Y1.2 | C26.1 12.11,40.57 Y1.4 | 9.31,44.97 C27.1 | C27.1 | C1.1 | C1.1 | 17.95,35.6 | v23.7,9.56 v23.71,9.56 24,9.85
  Bottom 0.254: v23.7,9.56 24,9.86 24,11.3 | v16.5,9.61 J1.2 | v18,9.61 | v18,9.61 J1.5 | v19.5,9.61 | v19.5,9.61 J1.8 | v21,9.61 | v21,9.61 J1.11
  Bottom 0.305: R8.2 9.25,27.76 8.4,26.91 8.4,25.41 v8.7,25.11 9.19,24.62 R7.2
  Bottom 0.406: J1.22 13.14,10.56 | 13.14,10.56 11.8,10.56 11.8,10.5 | 13.14,10.56 J1.22 | J1.22 14.3,10.56 14.3,10.55 | J1.22 13.25,12.35 J1.21 | J1.21 14.3,4.6 | J1.21 12.2,4.6 | J1.21 13.25,2.8 | J1.20 27.75,6.35 | J1.20 27.75,2.8 | J1.20 28.85,4.6 | J1.20 26.7,4.6 | J1.23 27.75,8.8 | J1.23 27.75,12.45 | J1.23 28.9,10.56 28.9,10.5 | J1.23 26.75,10.56 26.75,10.55
  Bottom 0.508: v19.55,47.06 19.55,46.96 C10.2 | v25,18.21 D3.2 | v20.5,18.21 D2.2 | v16,18.21 D1.2 | C2.2 7.4,52.01 U2.2
  Bottom 0.635: 25.4,43.61 C25.2 | C25.2 v26.1,43.61 | C2.2 v7.1,53.01 | 25.4,22.31 v25.9,22.31 | v22.8,22.31 22.3,22.31 22.3,22.41 C11.2 | C3.2 v13.7,52.71 C16.2 | C12.2 | v13,21.31 C12.2 | C12.2 | C15.2 C12.2 | 25.4,22.41 C5.2 | R8.2 10.95,27.76 C7.2 | v11,30.21 C9.2 | v11,35.81 C8.2 | v28.98,32.37 | v28.98,32.37 C14.2 | C1.1 28.98,34.42 C4.2 v28.98,32.37 | v28.98,32.37 | v24.7,40.91 24.71,40.9 C23.2 C22.2 | v22.01,39.57 | v22.01,39.57 C17.2 | C19.2 v19.31,40.97 C18.2 | C19.2 | C18.2 | v22.01,39.57 R1.1 | R1.1 | v15.2,40.91 C21.2 C20.2 | v19.55,47.06 19.55,47.16 C13.2 | C24.2 25.4,43.66 C25.2 | C10.2
  other vias: 9.61,37.87 8.21,39.67 8.21,41.77 8.21,43.87 8.21,45.77 8.71,48.17 11.21,48.17 13.21,45.77 13.61,43.87 13.61,41.77 13.61,39.67 20.5,0.8 40,1.2 1,1.2
  pour Top (isolate 0.254): 0,1.7 0,61.71 4,65.71 33.5,65.71 33.8,65.68 34.1,65.6 34.38,65.47 34.62,65.3 34.84,65.08 35.02,64.83 35.14,64.56 35.22,64.26 35.25,63.96 35.25,57.01 39.3,57.01 arc-90 41.05,55.26 41.05,1.7 arc-90 39.35,0 1.7,0 arc-90
  pour Bottom (isolate 0.254, rank 3): 0,1.75 0,61.71 4,65.71 33.5,65.71 33.8,65.68 34.1,65.6 34.38,65.47 34.62,65.3 34.84,65.08 35.02,64.83 35.14,64.56 35.22,64.26 35.25,63.96 35.25,57.01 39.3,57.01 arc-90 41.05,55.26 41.05,1.75 arc-90 39.3,0 1.75,0 arc-90
  pour GND (isolate 0.152, rank 2): 0,1.75 0,61.71 4,65.71 33.5,65.71 33.8,65.68 34.1,65.6 34.38,65.47 34.62,65.3 34.84,65.08 35.02,64.83 35.14,64.56 35.22,64.26 35.25,63.96 35.25,57.01 39.3,57.01 arc-90 41.05,55.26 41.05,1.75 arc-90 39.3,0 1.75,0 arc-90
HOTPLUG_DET  (via drill 0.3 pad 0.61)
  Top 0.203: v25.9,24.21 25.1,24.21 24.2,25.11 15.1,25.11 12.5,27.71 v12.5,28.41
  Bottom 0.152: U1.51
  Bottom 0.203: v25.9,24.21 26.8,23.31 26.8,16.31 | v12.5,28.41 12.85,28.76 U1.51
  Bottom 0.305: 25,12.92 25,14.81 25.9,15.71 25.95,15.76 D3.4 26.8,16.31 | 25,12.92 | 25,12.92 J1.19 | 26.8,16.31 | 26.8,16.31 27.75,16.31 R12.2
HPCOM
  Bottom 0.203: J2.6B | J2.6B
  Bottom 0.254: J2.6B 38.2,51.01 36.2,51.01 J4.4
HPL
  Bottom 0.203: J2.4B | J2.4B
  Bottom 0.254: J2.4B 38.34,53.41 36.34,53.41 J4.2
HPR
  Bottom 0.203: J2.8B | J2.8B
  Bottom 0.254: J2.8B 38.26,48.41 36.26,48.41 J4.6
LCD_CLK  (via drill 0.3 pad 0.61)
  Top 0.203: v7.3,37.41 8.3,37.41 8.6,37.11 13.8,37.11 14.8,36.11 20.6,36.11 20.91,36.42 v20.91,37.37
  Bottom 0.203: v7.3,37.41 7.3,14.91 5.2,12.81 2.74,12.81 J2.35A | U1.82 20.75,36.31 20.91,36.47 v20.91,37.37
LCD_D2
  Bottom 0.152: R11.1 13.2,48.16 13.2,47.91
  Bottom 0.254: 13,48.11 13.2,47.91 U3.2 | R11.1 12.25,48.91 8.3,48.91 7.5,48.11 7.5,44.36 7.4,44.26 7.4,38.81 6.8,38.21 3.1,38.21 2.7,37.81 2.7,35.63 J2.17A
LCD_D3  (via drill 0.3 pad 0.61)
  Top 0.203: v21.7,24.41 14.8,24.41 7.32,31.89 J2.20A | J2.20A
  Bottom 0.203: v21.7,24.41 21.8,24.41 21.95,24.56 U1.26 | U1.26
LCD_D4  (via drill 0.3 pad 0.61)
  Top 0.203: 22.45,24.31 v22.6,24.31 22.1,23.81 14.7,23.81 7.9,30.61 2.78,30.61 J2.19A
  Bottom 0.203: v22.6,24.31 22.35,24.56 U1.25
LCD_D5  (via drill 0.3 pad 0.61)
  Top 0.203: J2.22A 4.08,29.31 5.05,29.31 8.5,29.31 14.4,23.41 26.2,23.41 27,24.21 27.03,24.23 v27.03,25.27
  Bottom 0.203: v27.03,25.27 26.03,25.27 24.53,26.76 U1.21
LCD_D6  (via drill 0.3 pad 0.61)
  Top 0.203: v26.33,25.97 27.24,25.97 27.6,25.61 27.6,24.01 26.6,23.01 14.1,23.01 9,28.11 2.74,28.11 J2.21A
  Bottom 0.203: v26.33,25.97 26.03,25.97 24.83,27.16 U1.20
LCD_D7  (via drill 0.3 pad 0.61)
  Top 0.203: v27.03,26.67 27.24,26.67 28,25.91 28,23.11 25.1,20.21 10.7,20.21 6.9,24.01 4.7,26.21 4.1,26.81 J2.24A
  Bottom 0.203: v27.03,26.67 25.93,26.67 25.03,27.56 U1.19
LCD_D10  (via drill 0.3 pad 0.61)
  Top 0.203: v26.33,27.37 26.38,27.31 27.3,27.31 28.4,26.21 28.4,22.81 25.4,19.81 10.5,19.81 4.7,25.61 2.7,25.61 J2.23A
  Bottom 0.203: U1.16 24.73,28.76 24.87,28.62 24.87,28.32 25.83,27.37 v26.33,27.37 | U1.16
LCD_D11  (via drill 0.3 pad 0.61)
  Top 0.203: v27.03,28.07 27.24,28.07 28.8,26.51 28.8,22.64 28.57,22.41 25.57,19.41 9.8,19.41 4.94,24.27 J2.26A
  Bottom 0.203: U1.15 24.83,29.16 25.93,28.07 v27.03,28.07
LCD_D12  (via drill 0.3 pad 0.61)
  Top 0.203: v26.33,28.77 26.37,28.81 27.2,28.81 29.2,26.81 29.2,22.51 25.7,19.01 8.8,19.01 5.4,22.41 4.8,23.01 2.76,23.01 J2.25A
  Bottom 0.203: U1.14 25.13,29.56 25.82,28.87 26.22,28.87 v26.33,28.77 | v26.33,28.77
LCD_D13  (via drill 0.3 pad 0.61)
  Top 0.203: v27.03,29.47 27.14,29.47 29.6,27.01 29.6,21.61 25.4,17.41 9.6,17.41 5.3,21.71 5.28,21.73 J2.28A
  Bottom 0.203: v27.03,29.47 25.73,29.47 25.24,29.96 U1.13 | U1.13
LCD_D14  (via drill 0.3 pad 0.61)
  Top 0.203: J2.27A 2.72,20.51 5.7,20.51 9.2,17.01 25.8,17.01 30,21.21 30,27.61 27.43,30.18 26.34,30.18 v26.33,30.17
  Bottom 0.203: U1.12 26.13,30.36 v26.33,30.17
LCD_D15  (via drill 0.3 pad 0.61)
  Top 0.203: J2.30A 4.06,19.21 6.1,19.21 8.7,16.61 26,16.61 30.4,21.01 30.4,29.01 27.25,32.16 25.63,32.16 v25.63,32.17
  Bottom 0.203: v25.63,32.17 25.42,31.96 U1.8
LCD_D18  (via drill 0.3 pad 0.61)
  Top 0.203: J2.29A 2.78,17.91 6.7,17.91 8.4,16.21 26.2,16.21 30.8,20.81 30.8,29.21 26.5,33.51 26.45,33.56 v25.52,33.56
  Bottom 0.203: U1.4 v25.52,33.56
LCD_D19  (via drill 0.3 pad 0.61)
  Top 0.203: J2.32A 4.08,16.61 7.3,16.61 8.1,15.81 26.4,15.81 31.2,20.61 31.2,31.91 28.6,34.51 26.1,34.51 26.1,34.44 v26.03,34.37
  Bottom 0.203: v26.03,34.37 25.33,34.37 24.92,33.96 U1.3
LCD_D20  (via drill 0.3 pad 0.61)
  Top 0.203: v25.53,35.27 28.44,35.27 31.6,32.11 31.6,20.41 26.6,15.41 2.74,15.41 J2.31A
  Bottom 0.203: v25.53,35.27 24.62,34.36 U1.2
LCD_D21  (via drill 0.3 pad 0.61)
  Top 0.203: v26.21,36.07 28.24,36.07 28.51,35.8 32,32.31 32,20.21 26.8,15.01 5,15.01 4.1,14.11 J2.34A
  Bottom 0.203: U1.1 24.21,34.76 25.52,36.07 | 25.52,36.07 | 25.52,36.07 v26.21,36.07
LCD_D22  (via drill 0.3 pad 0.61)
  Top 0.203: v27.11,36.87 28.04,36.87 32.4,32.51 32.4,20.11 26.9,14.61 6.5,14.61 4.7,12.81 2.8,12.81 J2.33A
  Bottom 0.203: v27.11,36.87 26.91,36.67 25.62,36.67 24.46,35.51 23.25,35.51 | U1.88 | U1.88 23.25,35.51 | U1.88 23.25,35.51
LCD_D23  (via drill 0.3 pad 0.61)
  Top 0.203: v27.81,37.67 32.8,32.68 32.8,19.91 27.1,14.21 6.7,14.21 4.06,11.57 J2.36A
  Bottom 0.203: U1.87 22.75,36.11 23,36.36 24.8,36.36 25.51,37.07 26.11,37.07 26.71,37.67 v27.81,37.67
LCD_DE  (via drill 0.3 pad 0.61)
  Top 0.203: v7.9,36.71 13.6,36.71 14.6,35.71 21.95,35.71 v23.91,37.67
  Bottom 0.203: v7.9,36.71 7.7,36.51 7.7,10.15 J2.40A | U1.84 21.55,36.1 21.62,36.17 21.62,36.49 22.66,37.52 23.37,37.52 23.51,37.67 v23.91,37.67
LCD_HSYNC  (via drill 0.3 pad 0.61)
  Top 0.203: J2.38A 4.42,9.03 9.2,13.81 27.5,13.81 33.2,19.51 33.2,33.31 28.15,38.36 28.14,38.37 v27.11,38.37
  Bottom 0.203: U1.86 22.35,36.21 22.85,36.71 24.66,36.71 26.31,38.37 v27.11,38.37
LCD_VSYNC  (via drill 0.3 pad 0.61)
  Top 0.203: J2.37A 2.82,7.71 5.1,7.71 10.8,13.41 27.7,13.41 33.6,19.31 33.6,33.51 28,39.11 27.94,39.17 v27.11,39.17
  Bottom 0.203: 21.99,35.6 21.99,35.55 U1.85 21.95,35.56 21.99,35.6 | 21.99,35.6 21.99,36.36 22.71,37.07 24.41,37.07 26.51,39.17 v27.11,39.17
N$1
  Bottom 0.203: 10.31,39.97 10.71,39.57 C26.2 | U1.67 14.75,36.23 13.31,37.67 11.21,37.67 10.71,38.17 C26.2 | C26.2 | 10.31,39.97 | 10.31,39.97 Y1.1
N$2
  Bottom 0.203: U1.68 15.15,36.53 12.91,38.77 12.91,43.77 | 11.91,45.87 Y1.3 | Y1.3 | 12.91,43.77 | 12.91,43.77 Y1.3 | 11.91,45.87 | 11.91,45.87 C27.2
N$3  (via drill 0.3 pad 0.61)
  Top 0.152: v22.01,42.5 20.3,40.79 20.3,36.81 20.31,36.8 v20.31,36.77
  Bottom 0.203: U1.80 19.95,36.51 20.26,36.82 20.31,36.87 v20.31,36.77 | R1.2 22.01,42 | 22.01,42
  Bottom 0.305: R1.2 22.01,42 v22.01,42.5
N$4
  Bottom 0.203: R7.1 10.21,26.9 11.9,26.9 13.36,28.36 U1.50
N$5
  Bottom 0.203: U1.65 13.15,34.36 12.76,34.75 12.76,36.38 11.9,37.24 9.26,37.24 8.2,36.18 8.2,30.51 8.2,30.46 R8.1
N$6
  Bottom 0.203: 14.31,41.22 14.31,37.97 15.55,36.73 U1.69 | 14.31,41.22 | 14.31,41.22 | 14.31,41.22 R5.1 | U1.69
N$7
  Bottom 0.635: L3.2 24.89,52.34 D4.1
N$17
  Bottom 0.203: 9.4,36.01 9.5,36.11 9.9,36.51 11.6,36.51 12.1,36.01 12.1,34.11 12.65,33.56 U1.63 | 9.4,36.01 | 9.4,36.01 R3.1
N$18
  Bottom 0.203: U1.64 12.95,33.96 12.43,34.48 12.43,36.2 11.72,36.91 9.4,36.91 8.6,36.11 8.6,31.61 9.35,30.86 R4.1
N$20  (via drill 0.3 pad 0.61)
  Top 0.203: v15.16,44.25 14.42,43.51 14.42,39.99 16.8,37.61 16.81,37.6 v16.81,37.57
  Bottom 0.152: U1.72
  Bottom 0.203: U1.72 16.75,37.51 v16.81,37.57
  Bottom 0.305: v15.16,44.25 R6.1 | R6.1
PWRON  (via drill 0.3 pad 0.61)
  Top 0.203: v27.4,64.61 27,65.01 7,65.01 6.2,64.21 6.2,59.61 5.6,59.01 5.6,46.15 J2.10A
  Bottom 0.203: v27.4,64.61 28.13,64.61 S1.1
  Bottom 0.508: S1.1 29.65,64.26 30.2,63.71 31.8,63.71 32.35,64.26 S1.2
  Bottom 0.635: S1.2
RST
  Bottom 0.203: 27.08,35.92 26.83,35.67 26.83,33.87 25.83,32.87 25.23,32.87 24.72,32.36 U1.7 | 27.08,35.92 | 27.08,35.92 R2.1 | U1.7 | J2.13B | J2.13B
  Bottom 0.254: J2.13B 34.3,42.21 34.3,48.91 33.5,49.71 29.88,49.71 J3.1 27.1,49.49 27.1,40.21 29.03,38.28 29.03,36.52 | 29.03,36.52 | 29.03,36.52 C1.2
  Bottom 0.635: R2.1 28.98,35.92 C1.2 | C1.2
S$11
  cutout Top (no thermals): 6.2,57.01 26.6,57.01 26.6,64.71 6.2,64.71
  cutout PWR (no thermals): 6.2,57.01 26.6,57.01 26.6,64.71 6.2,64.71
S$12
  cutout GND (no thermals): 6.2,57.01 26.6,57.01 26.6,64.71 6.2,64.71
  cutout Bottom (no thermals): 6.2,57.01 26.6,57.01 26.6,64.71 6.2,64.71
TMDS_CLK_N
  Bottom 0.152: U1.31 19.95,21.63 21.9,19.68 21.9,18.4 21.45,17.95 D2.4 21.45,15.71 21.15,15.41 21.15,13.04 21.5,12.69 J1.12 | J1.12
TMDS_CLK_P
  Bottom 0.152: 21.45,18.41 D2.3 | D2.3 21.45,19.66 19.55,21.56 U1.32 | 21.45,18.41 20.95,17.91 20.95,15.64 20.85,15.54 20.85,13.04 20.5,12.69 J1.10 | J1.10 | 21.45,18.41 D2.3
TMDS_DATA0_N
  Bottom 0.152: 19.55,18.6 19.55,18.41 20,17.95 20,15.7 19.65,15.35 19.65,13.04 20,12.69 J1.9 | 19.55,18.6 D2.1 | U1.34 18.75,19.81 D2.1 | J1.9 | D2.1 | D2.1 19.55,18.6
TMDS_DATA0_P
  Bottom 0.152: D2.6 19.55,16.43 | 19.55,16.43 19.55,17.95 18.35,19.15 U1.35 | D2.6 19.55,15.71 19.35,15.5 19.35,13.04 19,12.69 J1.7 | J1.7 | 19.55,16.43 | 19.55,16.43 D2.6
TMDS_DATA1_N
  Bottom 0.152: U1.36 17.95,20.03 17.4,19.48 17.4,18.4 16.95,17.95 D1.4 16.95,15.59 18.15,14.39 18.15,13.04 18.5,12.69 J1.6 | J1.6
  Bottom 0.203: U1.36
TMDS_DATA1_P
  Bottom 0.152: U1.37 17.55,20.06 16.95,19.46 | D1.3 16.95,18.41 16.5,17.95 16.5,15.61 17.85,14.26 17.85,13.04 17.5,12.69 J1.4 | D1.3 16.95,19.46 | J1.4 | 16.95,19.46 D1.3
TMDS_DATA2_N
  Bottom 0.152: U1.39 16.75,21.39 15.13,19.77 15.13,19.09 | D1.1 15.13,19.09 | D1.1 15.05,18.41 15.51,17.95 15.51,15.13 16.65,13.98 16.65,13.04 17,12.69 J1.3 | D1.1 | 15.13,19.09 D1.1 | J1.3
  Bottom 0.203: U1.39
TMDS_DATA2_P
  Bottom 0.152: U1.40 16.35,21.42 14.6,19.67 14.6,18.4 15.05,17.95 D1.6 15.05,15.71 15.2,15.56 15.2,15.01 16.35,13.86 16.35,13.04 16,12.69 J1.1 | J1.1
TWI1_SCK  (via drill 0.3 pad 0.61)
  Top 0.152: v5.7,26.51 9,26.51 9.75,25.76 14.9,20.61 21.6,20.61 v21.9,20.91 | v21.9,20.91 | v21.9,20.91 22,20.81
  Top 0.203: v5.5,35.31 5.5,34.41 8.7,31.21 11.4,31.21 v12.3,30.31
  Top 0.254: v5.5,35.31 5.5,40.11 4.8,40.81 2.74,40.81 J2.11A
  Bottom 0.152: J1.15 23,14.71 24.05,15.76 D3.6 | v21.9,20.91 21.9,20.81 23.5,19.21 23.5,16.86 23.75,16.61 D3.6 | D3.6 | U1.54
  Bottom 0.203: v5.7,26.51 5.5,26.71 v5.5,35.31 | v12.3,30.31 12.65,29.96 U1.54
  Bottom 0.254: J2.11A 2.74,40.81 5.8,40.81 6.25,41.26 R9.1
TWI1_SDA  (via drill 0.3 pad 0.61)
  Top 0.152: v6.6,27.21 8.8,27.21 9.45,26.56 15,21.01 20.7,21.01 21.3,21.61 22.3,21.61 v23,20.91
  Top 0.203: v6.4,34.61 6.4,34.51 8.9,32.01 11.8,32.01 v12.6,31.21
  Top 0.254: v6.4,34.61 6.4,42.11 5.2,43.31 2.78,43.31 J2.9A
  Bottom 0.152: J1.16 23.5,14.61 23.5,14.7 24.06,15.25 24.55,15.74 24.55,17.16 24.05,17.66 D3.1 | v23,20.91 24.05,19.86 D3.1 | D3.1 | D3.1
  Bottom 0.203: v6.6,27.21 6.4,27.41 v6.4,34.61 | v12.6,31.21 13.45,30.36 U1.55 | 6.25,45.66 R10.1
  Bottom 0.254: J2.9A 2.72,45.81 6.1,45.81 6.25,45.66
UART1-RX
  Top 0.203: J2.5B | J2.5B
  Top 0.254: J4.3 29.86,54.81 31.86,54.81 J2.5B
UART1-TX
  Top 0.203: J2.3B 36.88,52.33
  Top 0.254: J4.1 29.9,57.31 31.9,57.31 36.88,52.33 J2.3B
VCC_1V8
  Bottom 0.508: U2.5 12.75,51.06 C3.1 14.3,51.31 14.31,51.31 L2.2
VCC_3V3
  Bottom 0.203: R10.2 6.55,44.16 7.05,44.66 7.05,46.46 5.1,48.41 2.76,48.41 J2.5A
  Bottom 0.305: 6.1,50.91 2.74,50.91 J2.5A | 6.1,50.91 C2.1 | 6.1,50.91 6.1,53.21 6.7,53.81 19.2,53.81 20.16,52.84 20.16,49.86 L1.2 | U2.1 9.85,51.06 10.1,51.31 10.1,52.71 9.8,53.01 8.84,53.01 U2.3 | L1.2
  Bottom 0.508: 13,49.71 10.15,49.71 U2.1 7.25,51.06 C2.1
  Bottom 0.635: R10.2 R9.2
  pour Bottom (isolate 0.305, rank 2, no thermals): 22.4,49.41 22.4,53.21 21,54.61 6.3,54.61 5.2,53.51 5.2,51.11 2.3,51.11 1.9,50.71 1.3,50.71 0.7,50.11 0.7,49.01 1.2,48.51 1.5,48.21 5,48.21 6.8,46.41 7.2,46.41 7.2,49.11 7.5,49.41
VCC_5V
  Bottom 0.305: 22.01,56.01 3.3,56.01 2.8,55.51 2.8,53.51 J2.3A
  pour Bottom (isolate 0.305, no thermals): 26,53.51 26,56.61 1.5,56.61 0.5,55.61 0.5,51.11 1.8,51.11 2.8,52.11 2.8,52.81 3.5,53.51 4.8,53.51 6.2,54.91 21.1,54.91 22.5,53.51
VCC_5V_DCC  (via drill 0.3 pad 0.61)
  Bottom 0.152: v9.4,33.01
  Bottom 0.203: R3.2 9.4,33.5 | 9.4,33.5 | R4.2
  Bottom 0.254: v24.75,9.56 24.75,9.66 24.5,9.91 J1.18
  Bottom 0.305: J1.18
  Bottom 0.635: R3.2 9.4,33.5 v9.4,33.01 R4.2 | v24,42.81 24,43.56 C25.1 24,43.66 C24.1 | C24.1 24,45.81 24.5,46.31 D4.2 | C24.1 | C24.1 | D4.2
  pour PWR (isolate 0.152, no thermals): 23.7,43.5 24.8,43.5 27.1,41.2 27.1,38.2 28.6,36.7 32.7,32.6 32.7,32.2 32.7,18.6 25.7,11.6 25.7,9 25.2,8.5 24.6,8.5 24,9.1 24,11.4 22.5,12.9 15.7,12.9 8.2,20.4 8.2,33.2 8.9,33.9 9.4,33.9 10.1,33.2 10.1,22.7 14.7,18.1 23.2,18.1 30.8,25.7 30.8,31.4 24.7,37.5 24.7,40.9 23.3,42.3 23.3,43.1
XIO-P1
  Top 0.203: J2.14B | J2.14B
  Top 0.254: J2.14B 38.24,40.81 36,40.81 34.3,42.51 34.3,47.83 J3.2
XIO-P2
  Bottom 0.203: J2.15B | J2.15B
  Bottom 0.254: J2.15B 33.8,40.17 33.8,46.31 32.9,47.21 29.84,47.21 J3.3
XIO-P3
  Top 0.203: J2.16B | J2.16B
  Top 0.254: J2.16B 38.3,38.21 36.2,38.21 33.8,40.61 33.8,45.79 J3.4
XIO-P4
  Bottom 0.203: J2.17B | J2.17B
  Bottom 0.254: J2.17B 36.78,34.43 33.3,37.91 33.3,43.71 32.4,44.61 29.9,44.61 J3.5
XIO-P5
  Top 0.203: J2.18B | J2.18B
  Top 0.254: J2.18B 38.26,35.71 36.3,35.71 33.3,38.71 33.3,43.75 J3.6
XIO-P6
  Bottom 0.203: J2.19B | J2.19B
  Bottom 0.254: J2.19B 32.8,36.09 32.8,41.31 32,42.11 29.86,42.11 J3.7
XIO-P7
  Top 0.203: J2.20B | J2.20B
  Top 0.254: J2.20B 38.32,33.11 36,33.11 32.8,36.31 32.8,41.71 J3.8

### Text on the board
tPlace: PWRON | TX1 | HPL | 5V | RX1 | HPC | 3V3 | FEL | HPR | P0 | P1 | P2 | P3 | XIO | P5 | P4 | P6 | P7 | GND | GND | HDMI DIP | V1.0